# Altium schematic sheet controller.SchDoc
size A4; SheetNumber: 1; SheetTotal: 4
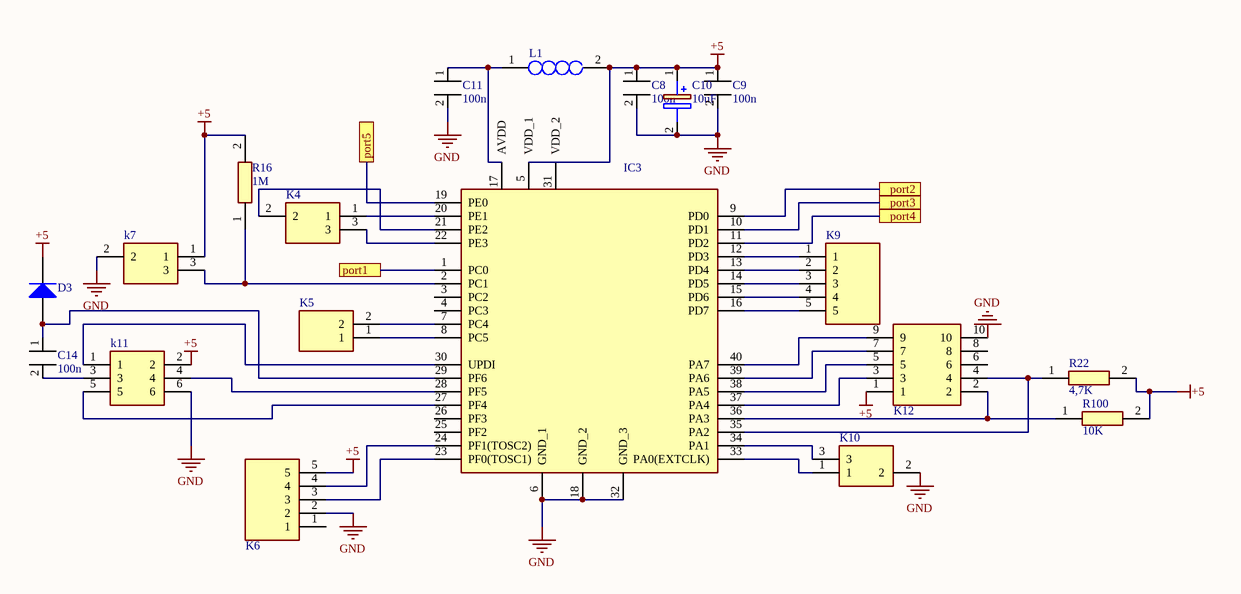
[diagram p0: controller.SchDoc]

## Parts
C8  100n  [FP-CRCW0805-e3-IPC_A]
C9  100n  [FP-CRCW0805-e3-IPC_A]
C10  10uF  [RCE7U2J103J3K1H03B]
C11  100n  [FP-CRCW0805-e3-IPC_A]
C14  100n  [FP-CRCW0805-e3-IPC_A]
D3  1N4148  [NXP-SOD27-2_V]  (value not drawn)
IC3  ATMEGA4809-PF  [DIP1543W58P254L5175H635Q40N]  (value not drawn)
K4  10129380-903001ALF  [10129380903001ALF]  (value not drawn)
K5  M20-9990245  [HDRV2W64P0X254_1X2_508X254X864P]  (value not drawn)
K6  825433-5  [HDRV5W63P0X254_1X5_1270X254X970P]  (value not drawn)
k7  10129380-903001ALF  [10129380903001ALF]  (value not drawn)
K9  825433-5  [HDRV5W63P0X254_1X5_1270X254X970P]  (value not drawn)
K10  10129380-903001ALF  [10129380903001ALF]  (value not drawn)
k11  M22-5320305R  [M225320305R]  (value not drawn)
K12  61201021721  [SHDRRA10W64P254X254_2X5_2036X885X910P]  (value not drawn)
L1  LQM18FN1R0M00D  [LQM18FN100M00D]  (value not drawn)
R16  1M  [FP-CRCW0805-e3-IPC_A]
R22  4,7K  [FP-CRCW0805-e3-IPC_A]
R100  10K  [FP-CRCW0805-e3-IPC_A]

## Ports
port1, port2, port3, port4, port5

## Nets
+5: C8.1(+) C9.1(+) C10.1(+) D3.2(K) K6.5 k7.1 k11.2 K12.1 L1.2 R16.2 R22.2 R100.2
GND: C8.2(-) C9.2(-) C10.2(-) C11.2(-) IC3.6(GND_1) IC3.18(GND_2) IC3.32(GND_3) K6.2 k7.2 K10.2 k11.6 K12.10
port1: IC3.1(PC0) ; port port1
port2: IC3.9(PD0) ; port port2
port3: IC3.10(PD1) ; port port3
port4: IC3.11(PD2) ; port port4
port5: IC3.19(PE0) ; port port5
NetC11_1: C11.1(+) L1.1
NetC14_1: C14.1(+) D3.1(A) IC3.29(PF6)
NetC14_2: C14.2(-) k11.3
NetIC3_2: IC3.2(PC1) k7.3 R16.1
NetIC3_7: IC3.7(PC4) K5.2
NetIC3_8: IC3.8(PC5) K5.1
NetIC3_12: IC3.12(PD3) K9.1
NetIC3_13: IC3.13(PD4) K9.2
NetIC3_14: IC3.14(PD5) K9.3
NetIC3_15: IC3.15(PD6) K9.4
NetIC3_16: IC3.16(PD7) K9.5
NetIC3_20: IC3.20(PE1) K4.1
NetIC3_21: IC3.21(PE2) K4.2
NetIC3_22: IC3.22(PE3) K4.3
NetIC3_23: IC3.23(PF0(TOSC1)) K6.3
NetIC3_24: IC3.24(PF1(TOSC2)) K6.4
NetIC3_27: IC3.27(PF4) k11.5
NetIC3_28: IC3.28(PF5) k11.4
NetIC3_30: IC3.30(UPDI) k11.1
NetIC3_33: IC3.33(PA0(EXTCLK)) K10.1
NetIC3_34: IC3.34(PA1) K10.3
NetIC3_35: IC3.35(PA2) K12.4 R22.1
NetIC3_36: IC3.36(PA3) K12.2 R100.1
NetIC3_37: IC3.37(PA4) K12.3
NetIC3_38: IC3.38(PA5) K12.5
NetIC3_39: IC3.39(PA6) K12.7
NetIC3_40: IC3.40(PA7) K12.9

Not connected (* = marked no-connect by the designer): IC3 3(PC2) 4(PC3) 5(VDD_1) 17(AVDD) 25(PF2) 26(PF3) 31(VDD_2); K6 1; K12 6 8

## Library data of the parts
C8 C9 C11 C14 = MAL215097101E3: Capacitor Polarised; Manufacturer_Name: Vishay; Datasheet Link: https://componentsearchengine.com/Datasheets/2/MAL215097101E3.pdf; Height: 10.5mm; Manufacturer_Part_Number: MAL215097101E3
C10 = Component_1
D3 = CMP-0648-00002-1: High-speed Diode, 100 V, 450 mA, 2-Pin SOD27, RoHS; Manufacturer: NXP Semiconductors; Configuration: Single; IR (VR: 20 V)=25 nA; IFRM: 450 mA; IFSM: 4 A Max.; Trr: 4 ns Max.; Cd: 4 pF Max.; VR: 100 V Max.; VF (IF: 10 mA)=1 V; IF: 200 mA Max.; ComponentLink1Description: Manufacturer URL; RoHS: TRUE; ComponentLink1URL: http://www.nxp.com/; ComponentLink3Description: Package Specification; DatasheetVersion: Aug-04; ComponentLink2Description: Datasheet; PackageVersion: Aug-04; PackageReference: SOD27; ComponentLink3URL: http://www.nxp.com/documents/data_sheet/1N4148_1N4448.pdf; Mounting Technology: Through Hole; ComponentLink2URL: http://www.nxp.com/documents/data_sheet/1N4148_1N4448.pdf; PartNumber: 1N4148; PackageDescription: 2-Pin Hermetically Sealed Glass Package, Axial Leaded, Dia 1.85 mm, Body Length 4.25 mm, Lead Spread 25.4 mm
IC3 = ATMEGA4809-PF: Integrated Circuit; Manufacturer_Name: Microchip; Datasheet Link: https://componentsearchengine.com//ATMEGA4809-PF.pdf; Height: 6.35mm; Mouser2 Part Number: 556-ATMEGA4809-PF; Mouser2 Price/Stock: https://www.mouser.com/Search/Refine.aspx?Keyword=556-ATMEGA4809-PF; Manufacturer_Part_Number: ATMEGA4809-PF
K4 k7 K10 = 10129380-903001ALF: Connector; Manufacturer_Name: Amphenol; Datasheet Link: https://cdn.amphenol-icc.com/media/wysiwyg/files/documentation/datasheet/boardwiretoboard/bwb_econostik_254headers.pdf; Height: 9.85mm; Manufacturer_Part_Number: 10129380-903001ALF
K5 = M20-9990245: Connector; Manufacturer_Name: Harwin; Datasheet Link: https://componentsearchengine.com//M20-9990245.pdf; Height: 8.64mm; Mouser2 Part Number: 855-M20-9990245; Mouser2 Price/Stock: https://www.mouser.com/Search/Refine.aspx?Keyword=855-M20-9990245; Manufacturer_Part_Number: M20-9990245
K6 K9 = 825433-5: Connector; Manufacturer_Name: TE Connectivity; Datasheet Link: https://componentsearchengine.com//825433-5.pdf; Height: 9.7mm; Mouser2 Part Number: 571-825433-5; Mouser2 Price/Stock: https://www.mouser.com/Search/Refine.aspx?Keyword=571-825433-5; Manufacturer_Part_Number: 825433-5
k11 = M22-5320305R: Connector; Manufacturer_Name: Harwin; Datasheet Link: https://cdn.harwin.com/pdfs/M22-532R.pdf; Height: 7.3mm; Manufacturer_Part_Number: M22-5320305R
K12 = 61201021721: Connector; Manufacturer_Name: Wurth Elektronik; Datasheet Link: https://componentsearchengine.com//61201021721.pdf; Height: 9.1mm; Mouser2 Part Number: 710-61201021721; Mouser2 Price/Stock: https://www.mouser.com/Search/Refine.aspx?Keyword=710-61201021721; Manufacturer_Part_Number: 61201021721
L1 = LQM18FN1R0M00D: Inductor; Manufacturer_Name: Murata Electronics; Datasheet Link: https://psearch.en.murata.com/inductor/product/LQM18FN1R0M00%23.html; Height: 0.9mm; Manufacturer_Part_Number: LQM18FN1R0M00D
R16 R22 R100 = CHP0805AFX-1000ELF: Resistor; Manufacturer_Name: Bourns; Datasheet Link: https://www.mouser.cn/datasheet/2/54/chp-a-1858677.pdf; Height: 0.6mm; Manufacturer_Part_Number: CHP0805AFX-1000ELF